# EAGLE schematic afe4400testpcb (EAGLE 8.6.0)
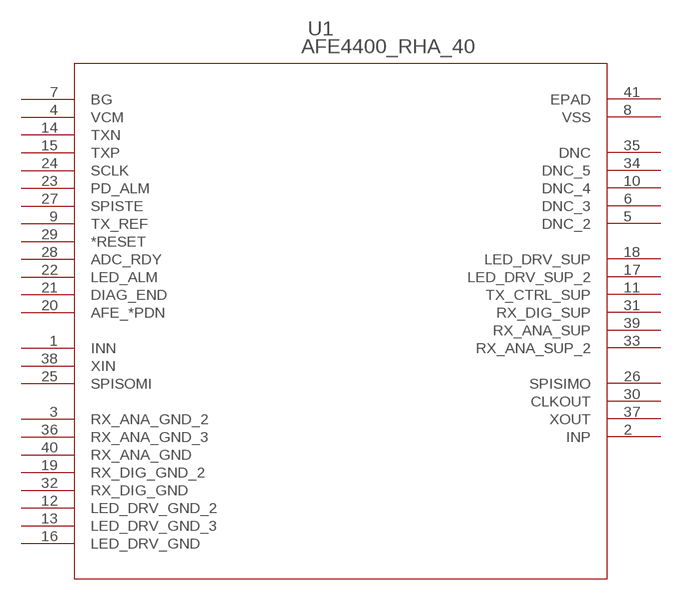
[diagram p0: schematic, sheet 1]

## Parts
U1  AFE4400_RHA_40  [RHA40_4P15X4P15]
Unconnected: U1.1(INN) U1.2(INP) U1.4(VCM) U1.5(DNC_2) U1.6(DNC_3) U1.7(BG) U1.9(TX_REF) U1.10(DNC_4) U1.11(TX_CTRL_SUP) U1.12(LED_DRV_GND_2) U1.13(LED_DRV_GND_3) U1.14(TXN) U1.15(TXP) U1.16(LED_DRV_GND) U1.17(LED_DRV_SUP_2) U1.18(LED_DRV_SUP) U1.19(RX_DIG_GND_2) U1.20(AFE_*PDN) U1.21(DIAG_END) U1.22(LED_ALM) U1.23(PD_ALM) U1.24(SCLK) U1.25(SPISOMI) U1.26(SPISIMO) U1.27(SPISTE) U1.28(ADC_RDY) U1.29(*RESET) U1.30(CLKOUT) U1.31(RX_DIG_SUP) U1.32(RX_DIG_GND) U1.33(RX_ANA_SUP_2) U1.34(DNC_5) U1.35(DNC) U1.36(RX_ANA_GND_3) U1.37(XOUT) U1.38(XIN) U1.39(RX_ANA_SUP) U1.40(RX_ANA_GND) U1.41(EPAD)

## Power pins joined to a net without a drawn wire
RX_ANA_GND_2: U1.3(RX_ANA_GND_2)
VSS: U1.8(VSS)

## Library data of the parts
U1 = AFE4400:AFE4400_RHA_40; MANUFACTURER_PART_NUMBER: afe4400_rha_40; VENDOR: Texas Instruments